# EAGLE schematic tiny_bot (EAGLE 6.5.0)
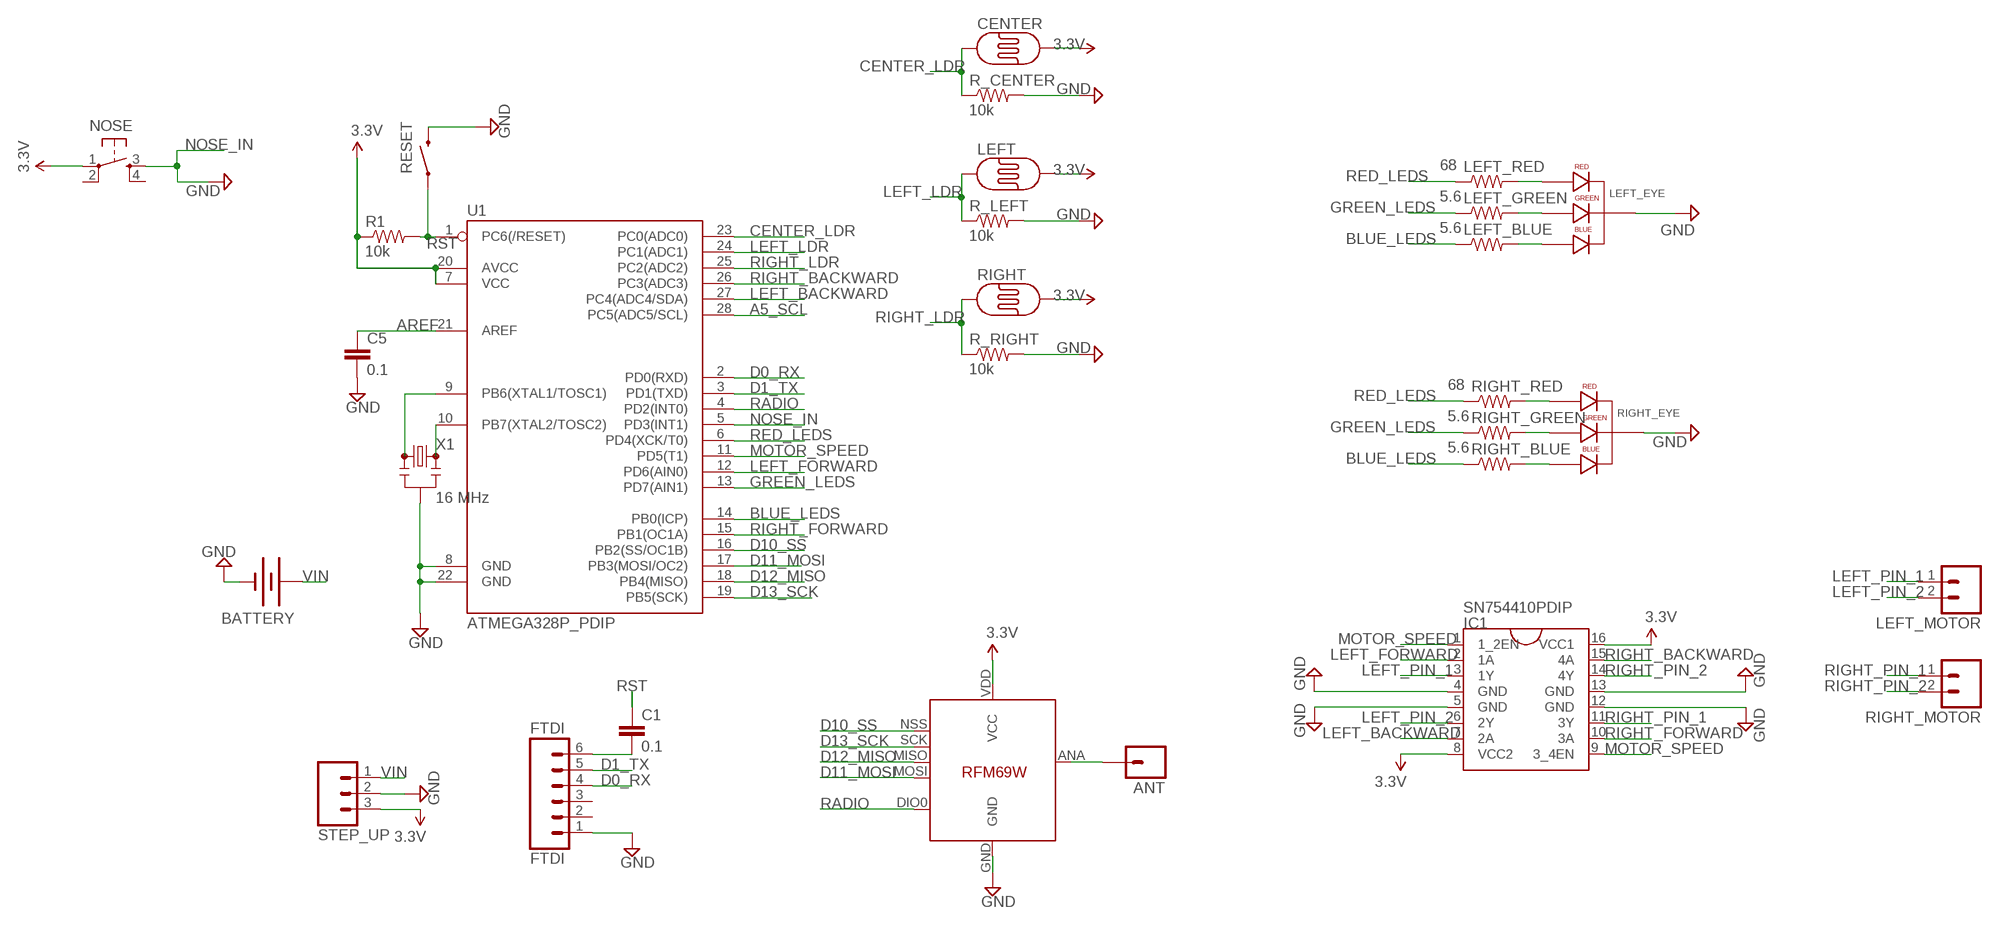
[diagram p0: schematic, sheet 1]

## Parts
ANT  M01PTH  [1X01]
BATTERY  BATTERYAAA  [BATTERY-AAA]
C1  0.1  CAPPTH  [CAP-PTH-SMALL]
C5  0.1  CAPPTH  [CAP-PTH-SMALL]
CENTER  PHOTOCELLPTH  [PHOTOCELL]
FTDI  FTDI  M06SIP  [1X06]
IC1  SN754410PDIP  [DIL16]
LEFT  PHOTOCELLPTH  [PHOTOCELL]
LEFT_BLUE  5.6  RESISTORPTH-1/4W  [AXIAL-0.4]
LEFT_EYE  LED-RGB-CC-THRUDIFFUSE  [LED-RGB-THRU]
LEFT_GREEN  5.6  RESISTORPTH-1/4W  [AXIAL-0.4]
LEFT_MOTOR  M02PTH  [1X02]
LEFT_RED  68  RESISTORPTH-1/4W  [AXIAL-0.4]
NOSE  TACTILE-SWITCH-PTH  [TAC-SWITCH-PTH]
R1  10k  RESISTORPTH-1/4W  [AXIAL-0.4]
R_CENTER  10k  RESISTORPTH-1/4W  [AXIAL-0.4]
R_LEFT  10k  RESISTORPTH-1/4W  [AXIAL-0.4]
R_RIGHT  10k  RESISTORPTH-1/4W  [AXIAL-0.4]
RESET  SWITCH-MOMENTARY-2SMD  [TACTILE-SWITCH-SMD]
RIGHT  PHOTOCELLPTH  [PHOTOCELL]
RIGHT_BLUE  5.6  RESISTORPTH-1/4W  [AXIAL-0.4]
RIGHT_EYE  LED-RGB-CC-THRUDIFFUSE  [LED-RGB-THRU]
RIGHT_GREEN  5.6  RESISTORPTH-1/4W  [AXIAL-0.4]
RIGHT_MOTOR  M02PTH  [1X02]
RIGHT_RED  68  RESISTORPTH-1/4W  [AXIAL-0.4]
STEP_UP  M03PTH  [1X03]
U1  ATMEGA328P_PDIP  [DIL28-3]
U$5  RFM69HW  RFM69  [RFM69W-MINPADS]
X1  16 MHz  RESONATORPTH  [RESONATOR-PTH]

## Nets
A5_SCL: U1.28(PC5(ADC5/SCL))
AREF: C5.1 U1.21(AREF)
BLUE_LEDS: LEFT_BLUE.P$1 RIGHT_BLUE.P$1 U1.14(PB0(ICP))
CENTER_LDR: CENTER.1 R_CENTER.P$1 U1.23(PC0(ADC0))
D0_RX: FTDI.4 U1.2(PD0(RXD))
D1_TX: FTDI.5 U1.3(PD1(TXD))
D10_SS: U1.16(PB2(SS/OC1B)) U$5.NSS(SEL)
D11_MOSI: U1.17(PB3(MOSI/OC2)) U$5.MOSI
D12_MISO: U1.18(PB4(MISO)) U$5.MISO
D13_SCK: U1.19(PB5(SCK)) U$5.SCK
GND [power]: BATTERY.GND@1(-) C5.2 FTDI.1 IC1.4(GND) IC1.5(GND) IC1.12(GND) IC1.13(GND) LEFT_EYE.2(CATHODE) R_CENTER.P$2 R_LEFT.P$2 R_RIGHT.P$2 RESET.3 RIGHT_EYE.2(CATHODE) STEP_UP.2 U1.8(GND) U1.22(GND) U$5.GND X1.2
GREEN_LEDS: LEFT_GREEN.P$1 RIGHT_GREEN.P$1 U1.13(PD7(AIN1))
LEFT_BACKWARD: IC1.7(2A) U1.27(PC4(ADC4/SDA))
LEFT_FORWARD: IC1.2(1A) U1.12(PD6(AIN0))
LEFT_LDR: LEFT.1 R_LEFT.P$1 U1.24(PC1(ADC1))
LEFT_PIN_1: IC1.3(1Y) LEFT_MOTOR.1
LEFT_PIN_2: IC1.6(2Y) LEFT_MOTOR.2
MOTOR_SPEED: IC1.1(1_2EN) IC1.9(3_4EN) U1.11(PD5(T1))
N$1: U1.9(PB6(XTAL1/TOSC1)) X1.1
N$2: ANT.1 U$5.ANA(ANT)
N$3: LEFT_EYE.1(RED_CATHODE) LEFT_RED.P$2
N$4: RIGHT_EYE.1(RED_CATHODE) RIGHT_RED.P$2
N$5: LEFT_EYE.3(GREEN_CATHODE) LEFT_GREEN.P$2
N$6: LEFT_BLUE.P$2 LEFT_EYE.4(BLUE_CATHODE)
N$7: RIGHT_EYE.3(GREEN_CATHODE) RIGHT_GREEN.P$2
N$8: RIGHT_BLUE.P$2 RIGHT_EYE.4(BLUE_CATHODE)
N$20: C1.2 FTDI.6
N$21: U1.10(PB7(XTAL2/TOSC2)) X1.3
NOSE_IN: NOSE.3 U1.5(PD3(INT1)) ; supply symbol labelled GND
RADIO: U1.4(PD2(INT0)) U$5.DIO0
RED_LEDS: LEFT_RED.P$1 RIGHT_RED.P$1 U1.6(PD4(XCK/T0))
RIGHT_BACKWARD: IC1.15(4A) U1.26(PC3(ADC3))
RIGHT_FORWARD: IC1.10(3A) U1.15(PB1(OC1A))
RIGHT_LDR: R_RIGHT.P$1 RIGHT.1 U1.25(PC2(ADC2))
RIGHT_PIN_1: IC1.11(3Y) RIGHT_MOTOR.1
RIGHT_PIN_2: IC1.14(4Y) RIGHT_MOTOR.2
RST: C1.1 R1.P$2 RESET.1 U1.1(PC6(/RESET))
VCC: CENTER.2 IC1.8(VCC2) IC1.16(VCC1) LEFT.2 NOSE.1 R1.P$1 RIGHT.2 STEP_UP.3 U1.7(VCC) U1.20(AVCC) U$5.VDD(VCC) ; supply symbol labelled 3.3V
VIN: BATTERY.PWR@1(+) STEP_UP.1
Unconnected: FTDI.2 FTDI.3 NOSE.2 NOSE.4

## Library data of the parts
ANT = SparkFun-Connectors:M01: Header 1 Standard 1-pin 0.1" header. Use with straight break away headers (SKU : PRT-00116), right angle break away headers (PRT-00553), swiss pins (PRT-00743), machine pins (PRT-00117), and female headers (PRT-00115). SMTSO-256-ET is a "flush mount" nut for a 4-40 screw. The older package used to be too tight, and did not allow it to sit properly thru the drill hit. The latest (0.165DIA) fits nice and snug.
BATTERY = SparkFun-Electromechanical:BATTERY: Battery Holders Various common sizes : AA, AAA, 18650 (PRT-12895), 20mm coin cell and 12mm coin cell. 20MM_4LEGS, BATT-10373; PROD_ID: BATT-08571
C1 C5 = SparkFun-Passives:CAP: Capacitor Standard 0603 ceramic capacitor, and 0.1" leaded capacitor.
CENTER LEFT RIGHT = SparkFun-Sensors:PHOTOCELL: CdS photoresistor. This is a low cost way to detect light levels. Resistance decreases with more incoming light. SparkFun SKU: SEN-09088
FTDI = SparkFun-Connectors:M06: Header 6 Standard 6-pin 0.1" header. Use with straight break away headers (SKU : PRT-00116), right angle break away headers (PRT-00553), swiss pins (PRT-00743), machine pins (PRT-00117), and female headers (PRT-00115). Molex polarized connector foot print use with SKU : PRT-08094 with associated crimp pins and housings. NOTES ON THE VARIANTS LOCK and LOCK_LONGPADS... This footprint was designed to help hold the alignment of a through-hole component (i.e. 6-pin header) while soldering it into place. You may notice that each hole has been shifted either up or down by 0.005 of an inch from it's more standard position (which is a perfectly straight line). This slight alteration caused the pins (the squares in the middle) to touch the edges of the holes. Because they are alternating, it causes a "brace" to hold the component in place. 0.005 has proven to be the perfect amount of "off-center" position when using our standard breakaway headers. Although looks a little odd when you look at the bare footprint, once you have a header in there, the alteration is very hard to notice. Also, if you push a header all the way into place, it is covered up entirely on the bottom side. This idea of altering the position of holes to aid alignment will be further integrated into the Sparkfun Library for other footprints. It can help hold any component with 3 or more connection pins.
IC1 = AlexW-Eagle-Libraries:SN754410
LEFT_BLUE LEFT_GREEN LEFT_RED R1 R_CENTER R_LEFT R_RIGHT RIGHT_BLUE RIGHT_GREEN RIGHT_RED = SparkFun-Passives:RESISTOR: Resistor Basic schematic elements and footprints for 0603, 1206, and PTH resistors.
LEFT_EYE RIGHT_EYE = SparkFun-LED:LED-RGB-CC-THRU: RGB Through-hole common cathode LED SparkFun Storefront: COM-00105 (Clear) COM-09264 (Diffuse); PROD_ID: DIO-09434
LEFT_MOTOR RIGHT_MOTOR = SparkFun-Connectors:M02: Standard 2-pin 0.1" header. Use with - straight break away headers ( PRT-00116) - right angle break away headers (PRT-00553) - swiss pins (PRT-00743) - machine pins (PRT-00117) - female headers (PRT-00115) Molex polarized connector foot print use with: PRT-08233 with associated crimp pins and housings. 2.54_SCREWTERM for use with PRT-10571. 3.5mm Screw Terminal footprints for PRT-08084 5mm Screw Terminal footprints for use with PRT-08432
NOSE = GeekAmmo:TACTILE-SWITCH: Tactile Switch 4 Pins, SPST NO
RESET = SparkFun-Electromechanical:SWITCH-MOMENTARY-2: Various NO switches- pushbuttons, reed, etc; PROD_ID: SWCH-08247
STEP_UP = SparkFun-Connectors:M03: Header 3 Standard 3-pin 0.1" header. Use with straight break away headers (SKU : PRT-00116), right angle break away headers (PRT-00553), swiss pins (PRT-00743), machine pins (PRT-00117), and female headers (PRT-00115). Molex polarized connector foot print use with SKU : PRT-08232 with associated crimp pins and housings.
U1 = SparkFun-DigitalIC:ATMEGA328P_PDIP: uC used in the Arduino 32kb flash, 1k EEPROM, 2k SRAM This is the through-hole version of this chip.
U$5 = LowPowerLab:RFM69
X1 = SparkFun-FreqCtrl:RESONATOR: Resonator Small SMD resonator. Used, eg, on the Arduino Pro/ Pro Mini boards. 8MHz- XTAL-08895 16MHz- XTAL-08900

## Net classes
1 power: width 0.381 mm, clearance 0.254 mm